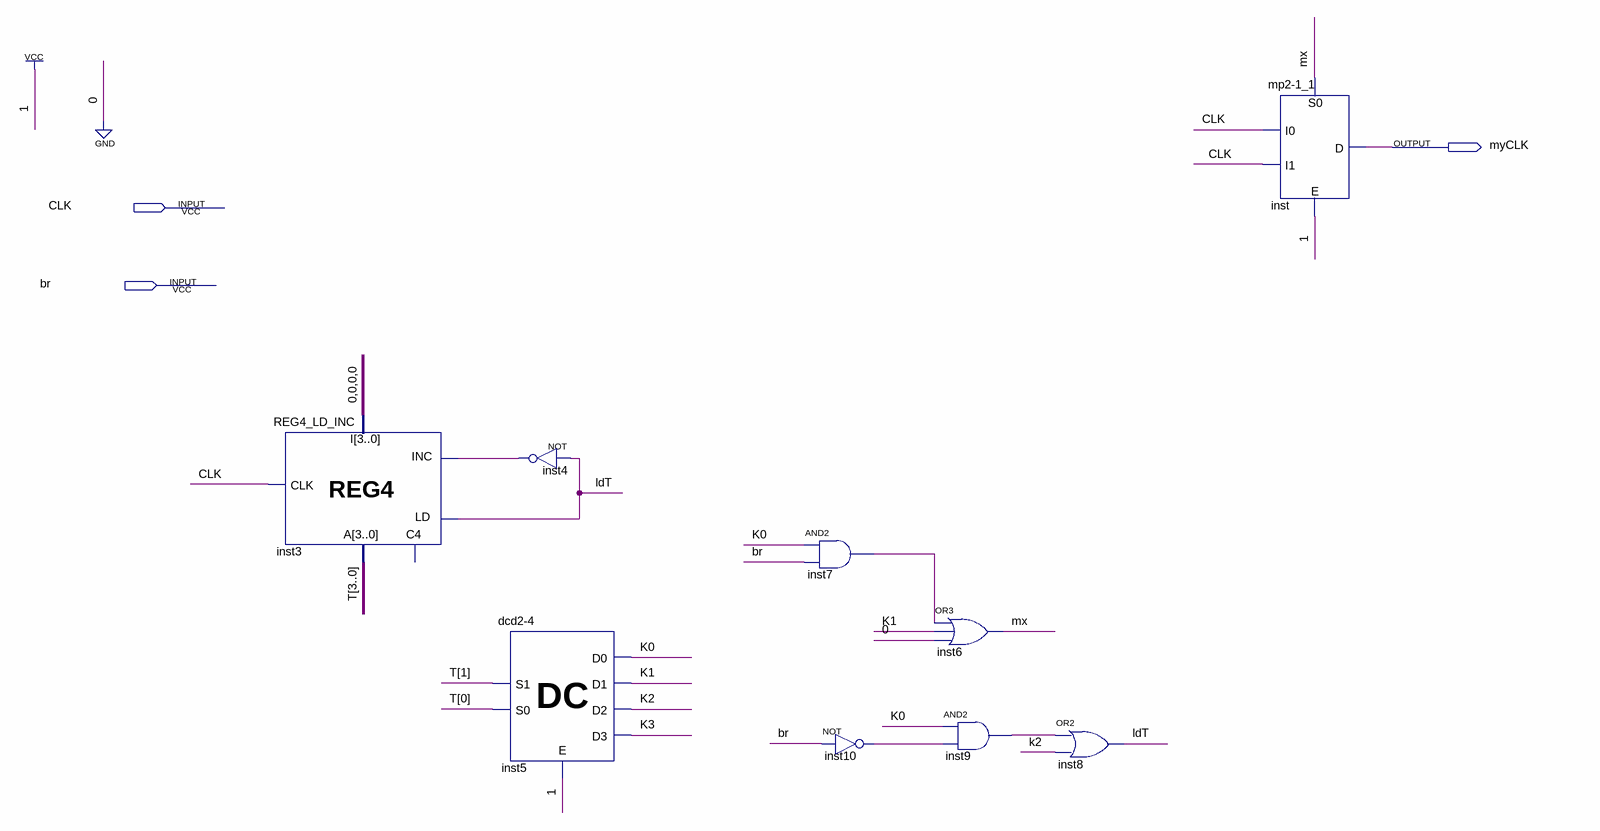
[diagram p0: schematic sheet]
// Quartus schematic myCLK.bdf as structural Verilog: 9 symbols, 3 pins
module myCLK (
  input  CLK,
  input  br,
  output myCLK
);

  wire inst4_out, inst7_out, inst9_out, inst10_out, K0, K1, K2, K3, ldT, mx;
  wire [3:0] T;

  REG4_LD_INC inst3 (.LD(ldT), .INC(inst4_out), .CLK(CLK), .I(4'b0000), .A(T));  // open: C4
  \dcd2-4  inst5 (.E(1'b1), .S1(T[1]), .S0(T[0]), .D0(K0), .D1(K1), .D2(K2), .D3(K3));
  not inst4 (inst4_out, ldT);
  and inst7 (inst7_out, K0, br);
  not inst10 (inst10_out, br);
  or inst6 (mx, inst7_out, K1, 1'b0);
  and inst9 (inst9_out, K0, inst10_out);
  or inst8 (ldT, inst9_out, K2);
  \mp2-1_1  inst (.E(1'b1), .I0(CLK), .I1(CLK), .S0(mx), .D(myCLK));
endmodule
